# Altium schematic sheet PA_Alim.SchDoc
size 254 x 228 mm
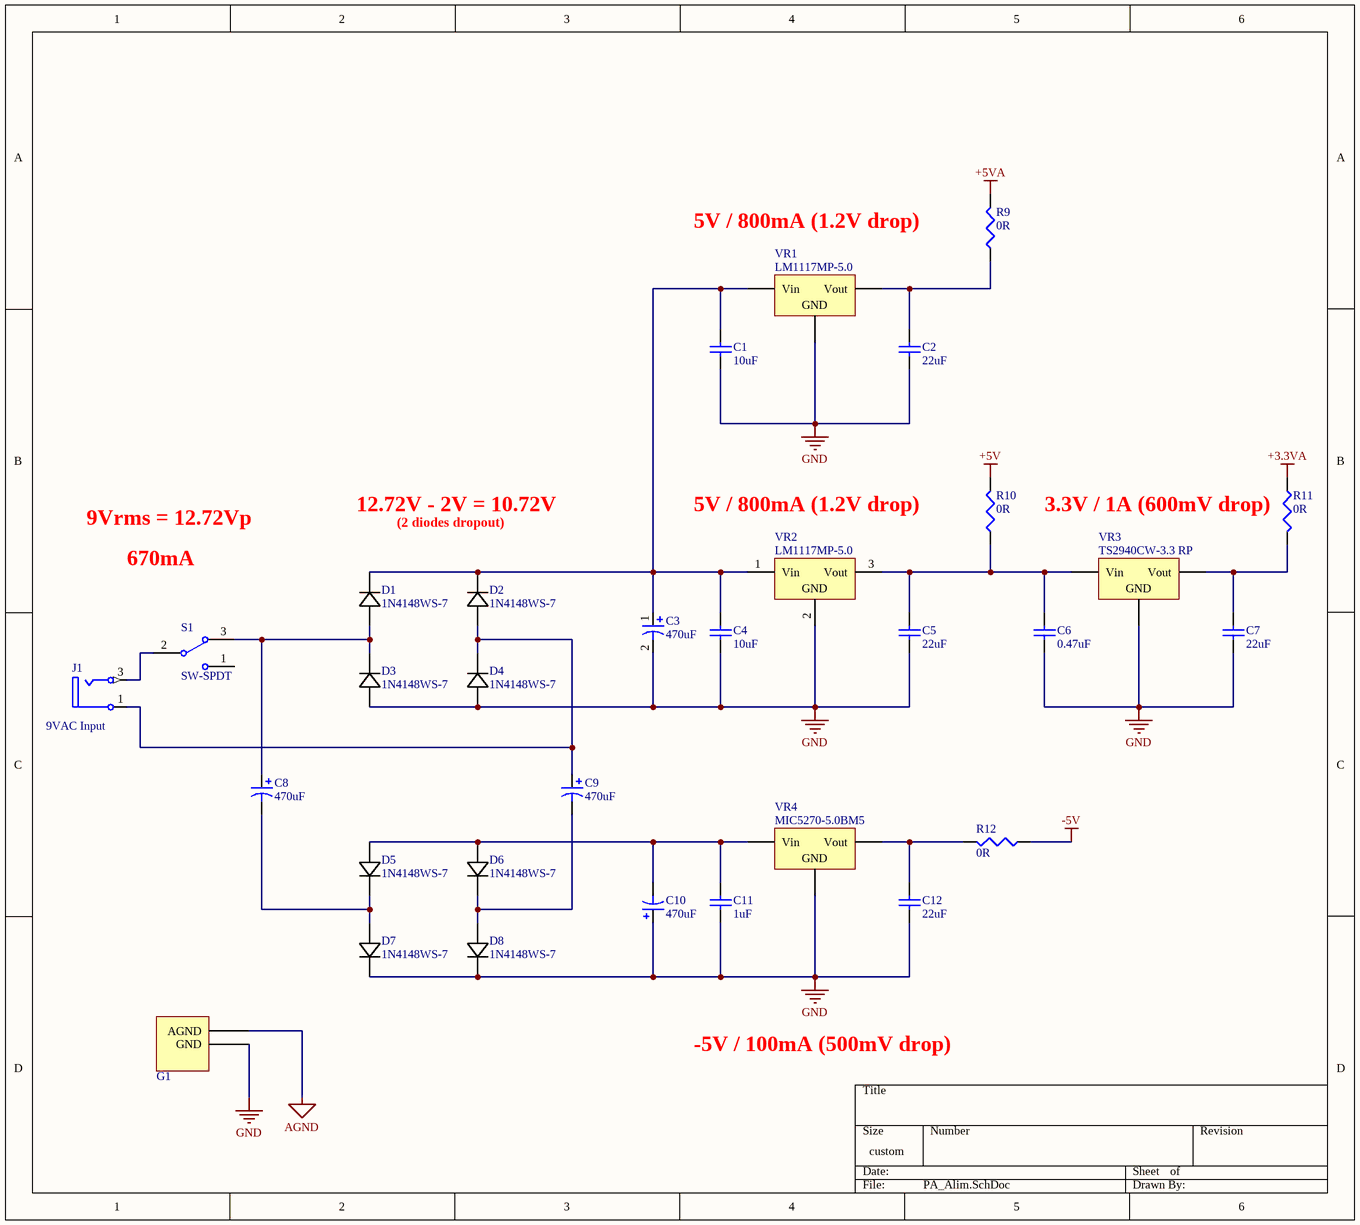
[diagram p0: PA_Alim.SchDoc]

## Parts
C1  10uF  [CAPC1608X08]
C2  22uF  [CAPC1608X08]
C3  470uF  [CAPC100100X102]
C4  10uF  [CAPC1608X08]
C5  22uF  [CAPC1608X08]
C6  0.47uF  [CAPC1608X08]
C7  22uF  [CAPC1608X08]
C8  470uF  [CAPC100100X102]
C9  470uF  [CAPC100100X102]
C10  470uF  [CAPC100100X102]
C11  1uF  [CAPC1608X08]
C12  22uF  [CAPC1608X08]
D1  1N4148WS-7  [SOD323-M]
D2  1N4148WS-7  [SOD323-M]
D3  1N4148WS-7  [SOD323-M]
D4  1N4148WS-7  [SOD323-M]
D5  1N4148WS-7  [SOD323-M]
D6  1N4148WS-7  [SOD323-M]
D7  1N4148WS-7  [SOD323-M]
D8  1N4148WS-7  [SOD323-M]
G1  Ground Connector  [GND]  (value not drawn)
J1  9VAC Input  [CLIFF ELECTRONIC COMPONENTS_FC681465P]
R9  0R  [RESC1608X05]
R10  0R  [RESC1608X05]
R11  0R  [RESC1608X05]
R12  0R  [RESC1608X05]
S1  SW-SPDT  [C&K_TS01ABE]
VR1  LM1117MP-5.0  [MP04A]
VR2  LM1117MP-5.0  [MP04A]
VR3  TS2940CW-3.3 RP  [SOT230P715X180-4N]
VR4  MIC5270-5.0BM5  [SOT95P280X130-5N]

## Nets
+3.3VA: R11.1
+5V: R10.2
+5VA: R9.2
-5V: R12.1
AGND: G1.1(AGND)
GND: C1.1 C2.1 C3.2 C4.1 C5.1 C6.1 C7.1 C10.1 C11.1 C12.1 D3.2 D4.2 D7.1 D8.1 G1.2(GND) VR1.2(GND) VR2.2(GND) VR3.2(GND) VR4.2(GND)
NetC1_2: C1.2 C3.1 C4.2 D1.1 D2.1 VR1.1(Vin) VR2.1(Vin)
NetC2_2: C2.2 R9.1 VR1.3(Vout)
NetC5_2: C5.2 C6.2 R10.1 VR2.3(Vout) VR3.1(Vin)
NetC7_2: C7.2 R11.2 VR3.3(Vout)
NetC8_1: C8.1 D1.2 D3.1 S1.3
NetC8_2: C8.2 D5.1 D7.2
NetC9_1: C9.1 D2.2 D4.1 J1.1(S)
NetC9_2: C9.2 D6.1 D8.2
NetC10_2: C10.2 C11.2 D5.2 D6.2 VR4.1(Vin)
NetC12_2: C12.2 R12.2 VR4.3(Vout)
NetJ1_3: J1.3(T) S1.2

Not connected (* = marked no-connect by the designer): S1 1

## Notes on the sheet
- 5V / 800mA (1.2V drop)
- 9Vrms = 12.72Vp
- 670mA
- 12.72V - 2V = 10.72V
- (2 diodes dropout)
- (near R11) 3.3V / 1A (600mV drop)
- -5V / 100mA (500mV drop)

## Library data of the parts
C1 C4 = Cap Semi: Capacitor (Semiconductor SIM Model); Fabricant: MURATA; Fournisseur: Farnell; RefFabricant: GRM188R60J106ME47J; RefFournisseur: 2611921; Value: 10uF; Case: 0603 [1608 Metric]; DataSheet: http://www.farnell.com/datasheets/2079165.pdf
C2 C5 C7 C12 = Cap Semi: Capacitor (Semiconductor SIM Model); Fabricant: MURATA; Fournisseur: Farnell; RefFabricant: GRM188R60J226MEA0D; RefFournisseur: 2666490; Value: 22uF; Case: 0603 [1608 Metric]; DataSheet: http://www.farnell.com/datasheets/1955681.pdf
C3 C8 C9 = Cap Pol1: Polarized Capacitor (Radial); Fabricant: PANASONIC ELECTRONIC COMPONENTS; Fournisseur: Farnell; RefFabricant: EEEFK1E471P; RefFournisseur: 9695800; Value: 470uF; Case: [10mm]; DataSheet: http://www.farnell.com/datasheets/2002520.pdf
C6 = Cap Semi: Capacitor (Semiconductor SIM Model); Fabricant: MURATA; Fournisseur: Farnell; RefFabricant: GRM188R61A474KA61D; RefFournisseur: 2695904; Value: 0.47uF; Case: 0603 [1608 Metric]; DataSheet: http://www.farnell.com/datasheets/2191628.pdf
C10 = Cap Pol1: Polarized Capacitor (Radial); Value: 470pf; Fabricant: PANASONIC ELECTRONIC COMPONENTS; Fournisseur: Farnell; RefFabricant: EEEFK1E471P; RefFournisseur: 9695800; Case: [10mm]; DataSheet: http://www.farnell.com/datasheets/2002520.pdf
C11 = Cap Semi: Capacitor; Fabricant: MURATA; Fournisseur: Farnell; RefFabricant: GRM188R60J105KA01D; RefFournisseur: 9527699; Value: 1uF; Case: 0603 [1608 Metric]; DataSheet: http://www.farnell.com/datasheets/2048127.pdf
D1-D8 = 1N4148WS-7: Diode signaux faibles; RefFournisseur: 2453269; Fabricant: ON SEMICONDUCTOR; Fournisseur: Farnell; RefFabricant: 1N4148WS; DataSheet: http://www.farnell.com/datasheets/2288055.pdf
G1 = GND: Ground Ultime
J1 = Phonejack2: Jack Socket Thru-Hole Vertical 2-Conductor Open Circuit; Fabricant: CLIFF ELECTRONIC COMPONENTS; Fournisseur: Farnell; RefFabricant: FC681465P; RefFournisseur: 1854512; DataSheet: http://www.farnell.com/datasheets/1855458.pdf; Case: Through-Hole_3
R9-R12 = Res3: Resistor; Value: 0; Case: 0603 [1608 Metric]
S1 = SW-SPDT: SPDT Subminiature Toggle Switch, Right Angle Mounting, Vertical Actuation; Fabricant: C & K COMPONENTS; Fournisseur: Farnell; RefFabricant: TS01ABE; RefFournisseur: 2435185; DataSheet: http://www.farnell.com/datasheets/1839865.pdf; Case: Through-Hole_5
VR1 VR2 = Volt Reg: Voltage Regulator; Fabricant: Texas Instrument; Fournisseur: Farnell; RefFournisseur: 9778209; DataSheet: http://www.farnell.com/datasheets/2019100.pdf; RefFabricant: LM1117MP-5.0
VR3 = Volt Reg: Voltage Regulator; Fabricant: TAIWAN SEMICONDUCTOR; Fournisseur: Farnell; RefFournisseur: 7261403; DataSheet: http://www.farnell.com/datasheets/2044143.pdf; RefFabricant: TS2940CW-3.3 RP
VR4 = Volt Reg: Voltage Regulator; Fabricant: MICROCHIP; Fournisseur: Farnell; RefFabricant: MIC5270-5.0YM5-TR; RefFournisseur: 2510308; DataSheet: http://www.farnell.com/datasheets/29611.pdf